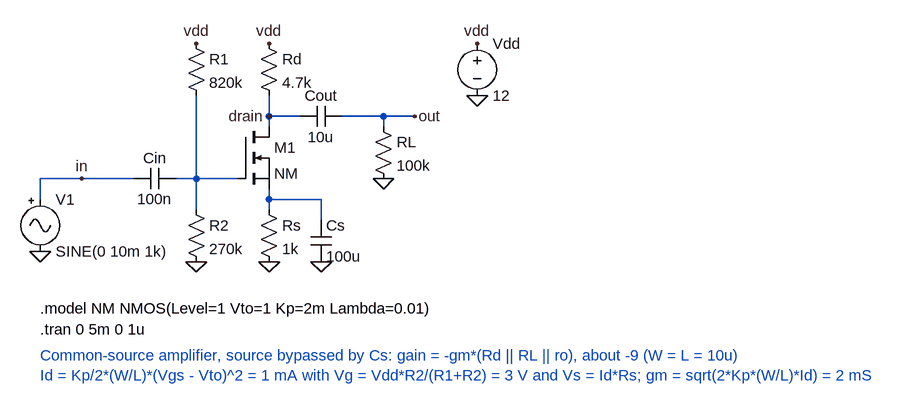
[diagram p0: schematic cs_amplifier.asc]
cs_amplifier.asc, the LTspice schematic file:
Version 4
SHEET 1 880 680
WIRE 0 288 0 320
WIRE 144 288 0 288
WIRE 240 288 208 288
WIRE 304 288 240 288
WIRE 240 160 240 336
WIRE 352 160 352 208
WIRE 400 192 352 192
WIRE 528 192 464 192
WIRE 576 192 528 192
WIRE 528 208 528 192
WIRE 352 304 352 336
WIRE 432 320 352 320
WIRE 432 352 432 320
FLAG 0 400 0
FLAG 64 288 in
FLAG 240 80 vdd
FLAG 352 80 vdd
FLAG 352 192 drain
FLAG 240 416 0
FLAG 352 416 0
FLAG 432 416 0
FLAG 528 288 0
FLAG 576 192 out
FLAG 672 80 vdd
FLAG 672 160 0
SYMBOL Misc\signal 0 304 R0
SYMATTR InstName V1
SYMATTR Value SINE(0 10m 1k)
SYMBOL cap 208 272 R90
WINDOW 0 0 32 VBottom 2
WINDOW 3 32 32 VTop 2
SYMATTR InstName Cin
SYMATTR Value 100n
SYMBOL res 224 64 R0
SYMATTR InstName R1
SYMATTR Value 820k
SYMBOL res 224 320 R0
SYMATTR InstName R2
SYMATTR Value 270k
SYMBOL nmos 304 208 R0
SYMATTR InstName M1
SYMATTR Value NM
SYMATTR SpiceLine l=10u w=10u
SYMBOL res 336 64 R0
SYMATTR InstName Rd
SYMATTR Value 4.7k
SYMBOL res 336 320 R0
SYMATTR InstName Rs
SYMATTR Value 1k
SYMBOL cap 416 352 R0
SYMATTR InstName Cs
SYMATTR Value 100u
SYMBOL cap 464 176 R90
WINDOW 0 0 32 VBottom 2
WINDOW 3 32 32 VTop 2
SYMATTR InstName Cout
SYMATTR Value 10u
SYMBOL res 512 192 R0
SYMATTR InstName RL
SYMATTR Value 100k
SYMBOL voltage 672 64 R0
SYMATTR InstName Vdd
SYMATTR Value 12
TEXT 0 488 Left 2 !.model NM NMOS(Level=1 Vto=1 Kp=2m Lambda=0.01)
TEXT 0 520 Left 2 !.tran 0 5m 0 1u
TEXT 0 560 Left 2 ;Common-source amplifier, source bypassed by Cs: gain = -gm*(Rd || RL || ro), about -9 (W = L = 10u)\nId = Kp/2*(W/L)*(Vgs - Vto)^2 = 1 mA with Vg = Vdd*R2/(R1+R2) = 3 V and Vs = Id*Rs; gm = sqrt(2*Kp*(W/L)*Id) = 2 mS

The netlist it stands for:
* cs_amplifier.asc
V1 in 0 SINE(0 10m 1k)
Cin N001 in 100n
R1 vdd N001 820k
R2 N001 0 270k
M1 drain N001 N002 N002 NM l=10u w=10u
Rd vdd drain 4.7k
Rs N002 0 1k
Cs N002 0 100u
Cout out drain 10u
RL out 0 100k
Vdd vdd 0 12
.model NMOS NMOS
.model PMOS PMOS
.lib standard.mos
.model NM NMOS(Level=1 Vto=1 Kp=2m Lambda=0.01)
.tran 0 5m 0 1u
* Common-source amplifier, source bypassed by Cs: gain = -gm*(Rd || RL || ro), about -9 (W = L = 10u)
* Id = Kp/2*(W/L)*(Vgs - Vto)^2 = 1 mA with Vg = Vdd*R2/(R1+R2) = 3 V and Vs = Id*Rs; gm = sqrt(2*Kp*(W/L)*Id) = 2 mS
.backanno
.end